# Altium schematic sheet MCU063A_CoverSheet.SchDoc
size 431 x 279 mm; Date: Not shown in title block; ApprovedBy: Not shown in title block; CheckedBy: Not shown in title block; Author: Not shown in title block; CompanyName: Not shown in title block; DrawnBy: Cody Watkins; Engineer: Not shown in title block; Organization: Not shown in title block; Address1: Not shown in title block; Address2: Not shown in title block; Address3: Not shown in title block; Address4: Not shown in title block; DocumentNumber: 1; Revision: Use project parameter SCH_Rev; SheetNumber: 1; SheetTotal: 11; PageSetup: Record=PageOptions|CenterHorizontal=True|CenterVertical=True|PrintScale=1.00|XCorrection=1.00|YCorrection=1.00|PrintKind=0|BorderSize=5000000|LeftOffset=0|BottomOffset=0|Orientation=2|PaperLength=1000|PaperWidth=1000|Scale=100|PaperSource=15|PrintQuality=600|MediaType=1|DitherType=10|PaperKind=Letter|PrintScaleMode=1; CurrentTime: Not shown in title block; CurrentDate: Not shown in title block; Time: Not shown in title block; DocumentFullPathAndName: Not shown in title block; DocumentName: Not shown in title block; ModifiedDate: Not shown in title block; ImagePath: Not shown in title block
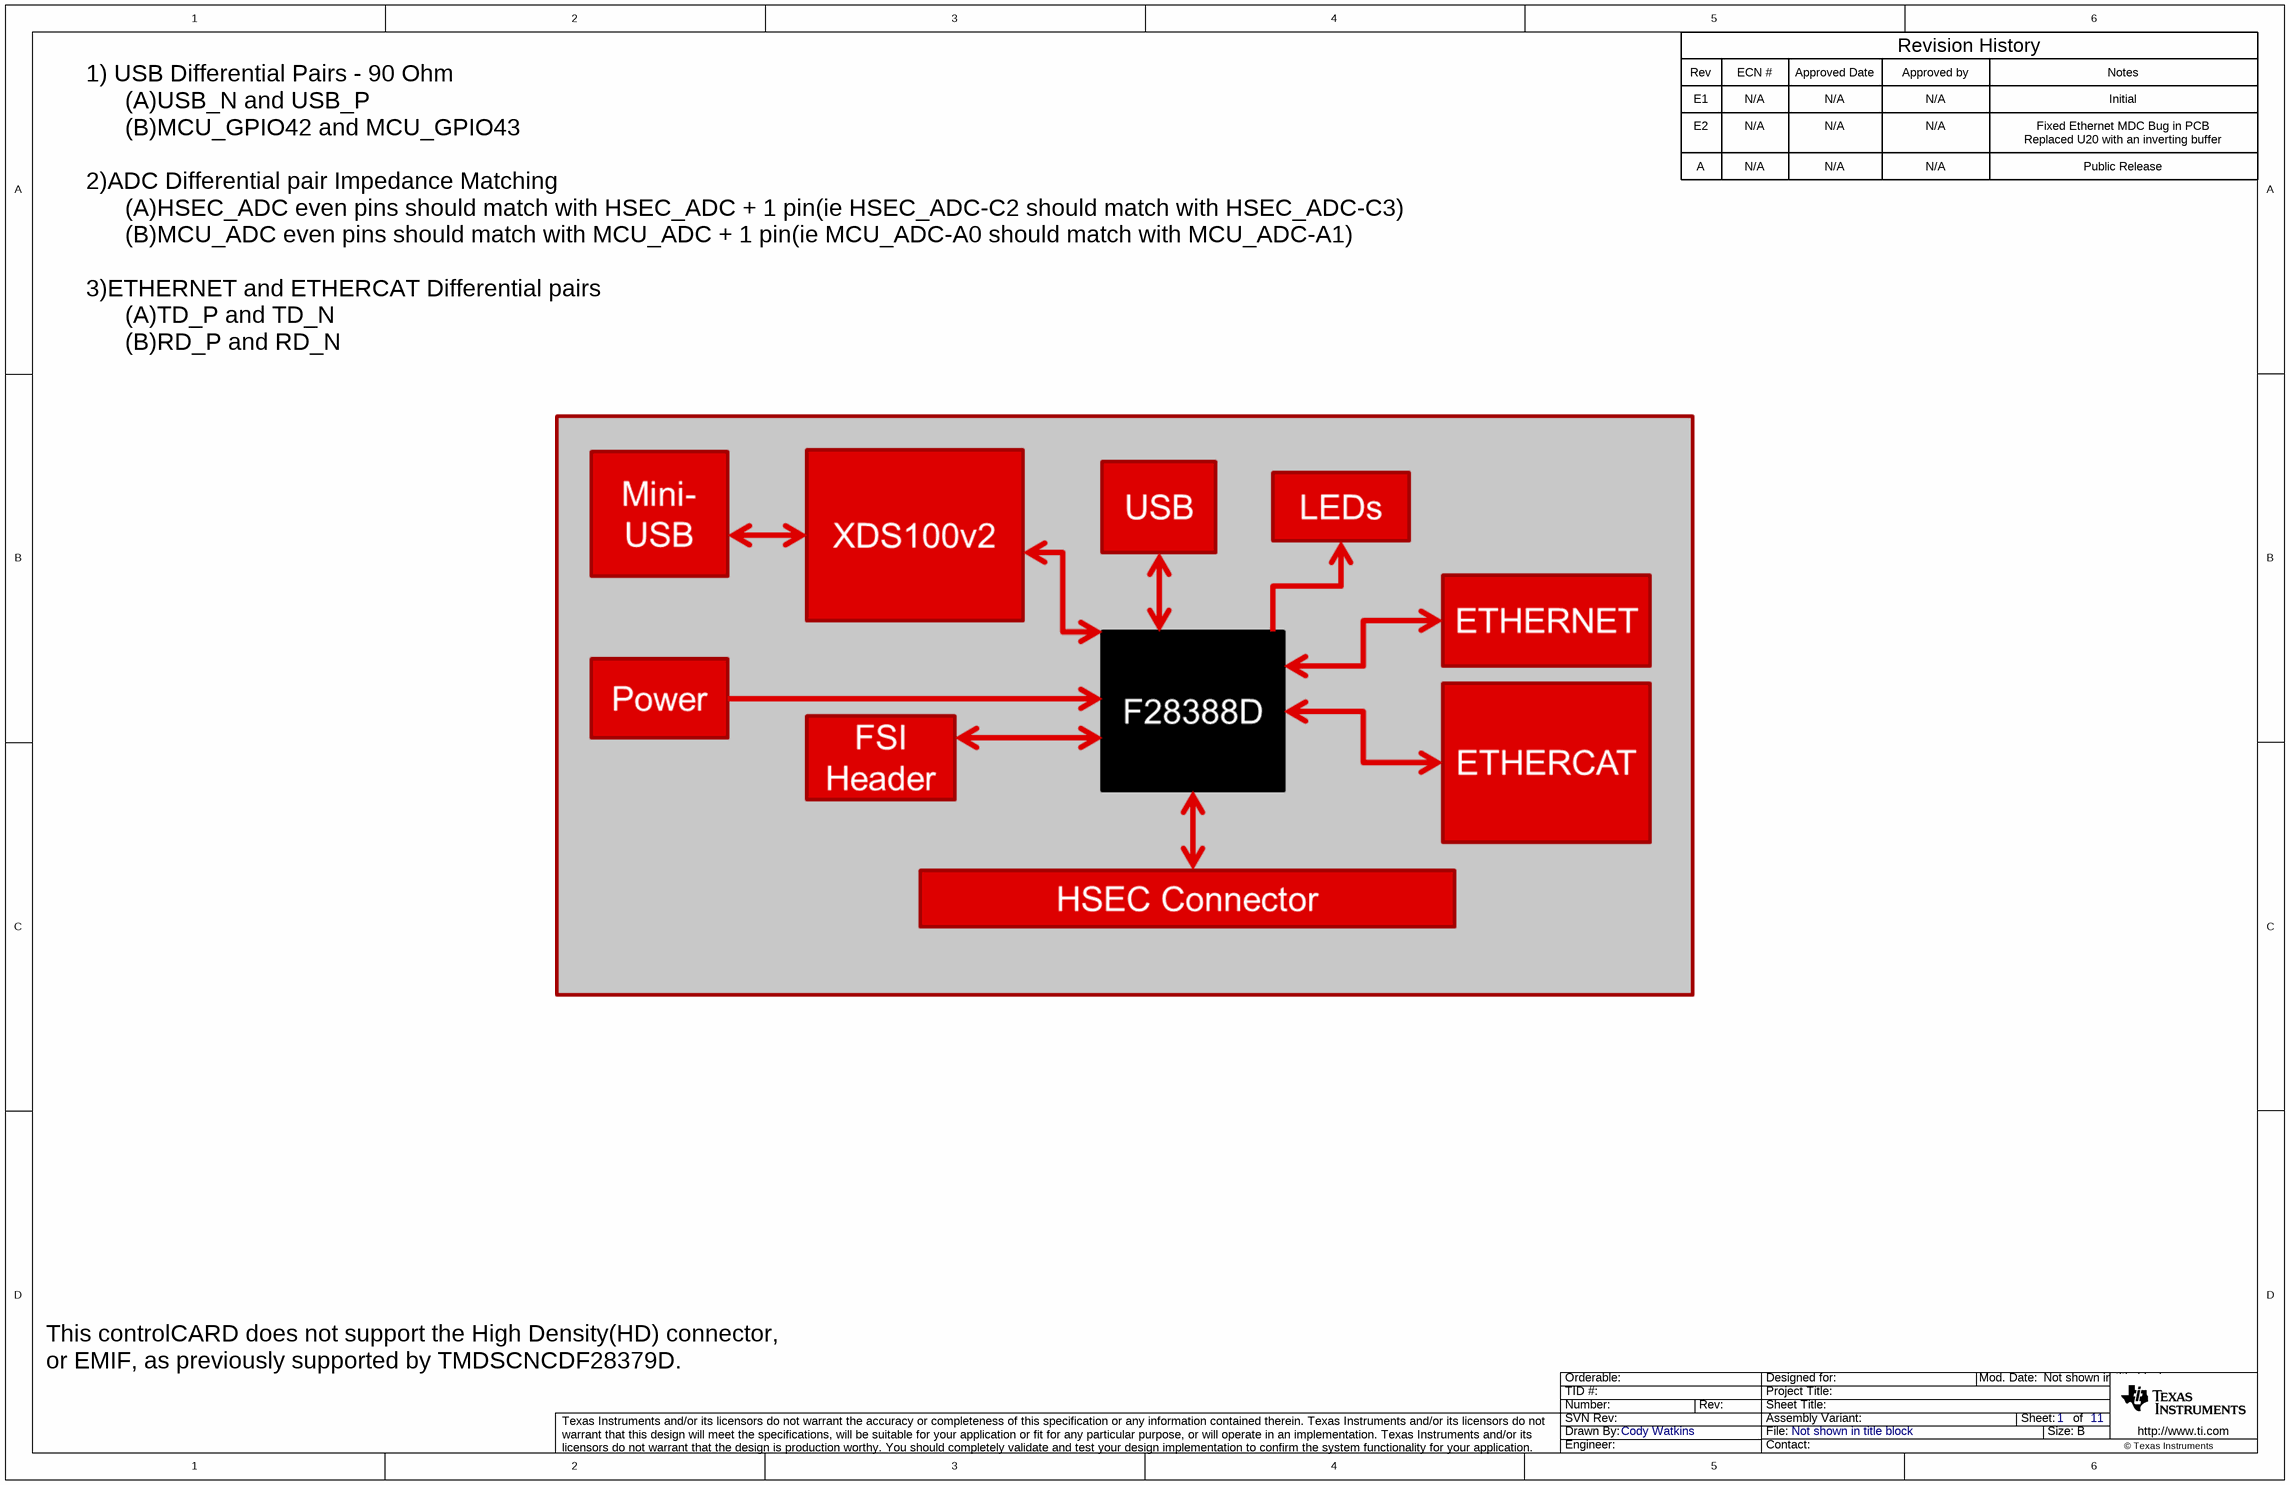
[diagram p0: MCU063A_CoverSheet.SchDoc]

## Notes on the sheet
- Rev
- E1
- ECN #
- N/A
- Approved Date
- Approved by
- Revision History
- Notes
- Initial
- E2
- A
- Public Release
- Fixed Ethernet MDC Bug in PCB
- Replaced U20 with an inverting buffer
- 1) USB Differential Pairs - 90 Ohm
  (A)USB_N and USB_P
  (B)MCU_GPIO42 and MCU_GPIO43
  2)ADC Differential pair Impedance Matching
  (A)HSEC_ADC even pins should match with HSEC_ADC + 1 pin(ie HSEC_ADC-C2 should match with HSEC_ADC-C3)
  (B)MCU_ADC even pins should match with MCU_ADC + 1 pin(ie MCU_ADC-A0 should match with MCU_ADC-A1)
  3)ETHERNET and ETHERCAT Differential pairs
  (A)TD_P and TD_N
  (B)RD_P and RD_N
- This controlCARD does not support the High Density(HD) connector, or EMIF, as previously supported by TMDSCNCDF28379D.
- Drawn By:
- SVN Rev:
- Number:
- TID #:
- Orderable:
- Rev:
- Sheet Title:
- File:
- Project Title:
- Designed for:
- Assembly Variant:
- Mod. Date:
- Sheet:
- Size:
- of
- B
- http://www.ti.com
- Texas Instruments and/or its licensors do not warrant the accuracy or completeness of this specification or any information contained therein. Texas Instruments and/or its licensors do not warrant that this design will meet the specifications, will be suitable for your application or fit for any particular purpose, or will operate in an implementation. Texas Instruments and/or its licensors do not warrant that the design is production worthy. You should completely validate and test your design implementation to confirm the system functionality for your application.
- Engineer:
- Contact:
- © Texas Instruments